# Altium project CAO_DMX.PrjPCB
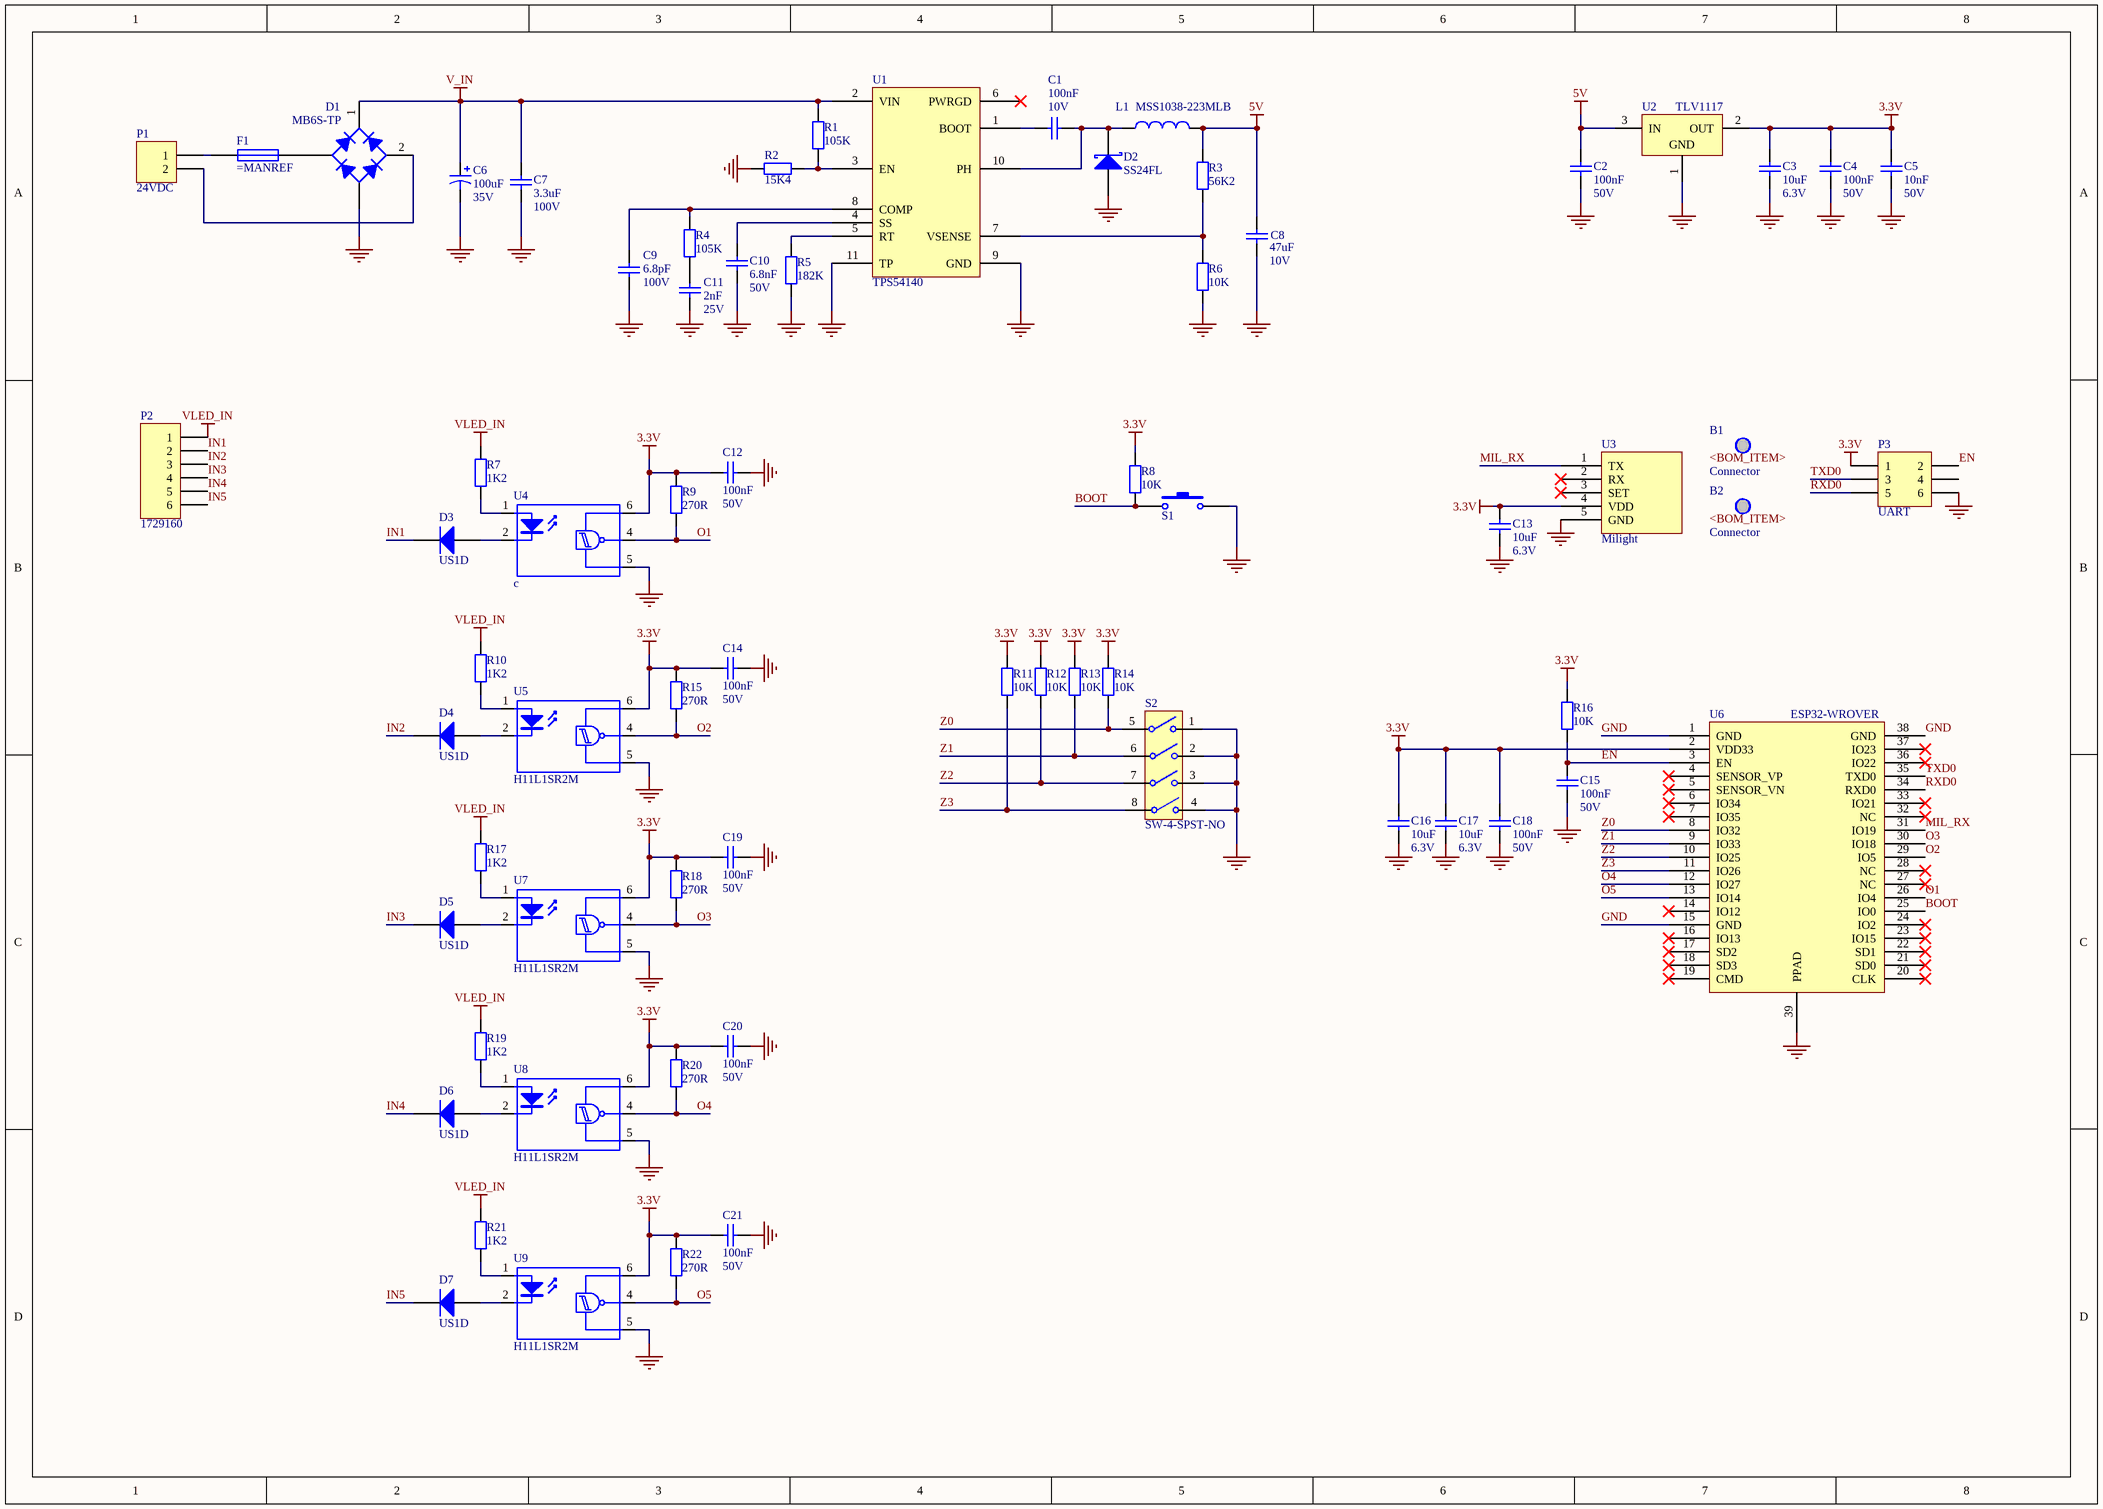
[diagram p0: CAO_DMX.SchDoc]
CompanyName: Micro-Device Tunisie; DocumentNumber: 1; DocumentScale: 1:1; DrawnBy: MG; SheetTotal: 1; Title: DMX Wifi Bridge
1 sheet, 68 parts. Net scope: global (net labels, ports and power ports of the same name join across sheets).
Board file: CAO_DMX.PcbDoc

## Sheet CAO_DMX.SchDoc: DMX Wifi Bridge
size A3; Organization: Micro Device Tunisie; Address1: Pépinière d’Entreprises Sousse-Tec; Address2: Espace Universitaire ISET SOUSSE; Address3: Cité Erriadh, 4023, Tunisia; Address4: contact@mdtunisie.com

### Parts
B1  Connector  (mechanical)
B2  Connector  (mechanical)
C1  Value 1: 100nF  Value 2: 10V  [CAPC1608N]  (hidden comment: Capacitor)
C2  Value 1: 100nF  Value 2: 50V  [CAPC1608N]  (hidden comment: Capacitor)
C3  Value 1: 10uF  Value 2: 6.3V  [CAPC2012N]  (hidden comment: Capacitor)
C4  Value 1: 100nF  Value 2: 50V  [CAPC1608N]  (hidden comment: Capacitor)
C5  Value 1: 10nF  Value 2: 50V  [CAPC1608N]  (hidden comment: Capacitor)
C6  Value 1: 100uF  Value 2: 35V  [ECAP_SMD_6.3]  (hidden comment: Polarized Capacitor)
C7  Value 1: 3.3uF  Value 2: 100V  [CAPC3216N]  (hidden comment: Capacitor)
C8  Value 1: 47uF  Value 2: 10V  [CAPC2012N]  (hidden comment: Capacitor)
C9  Value 1: 6.8pF  Value 2: 100V  [CAPC1608N]  (hidden comment: Capacitor)
C10  Value 1: 6.8nF  Value 2: 50V  [CAPC1608N]  (hidden comment: Capacitor)
C11  Value 1: 2nF  Value 2: 25V  [CAPC2012N]  (hidden comment: Capacitor)
C12  Value 1: 100nF  Value 2: 50V  [CAPC1608N]  (hidden comment: Capacitor)
C13  Value 1: 10uF  Value 2: 6.3V  [CAPC2012N]  (hidden comment: Capacitor)
C14  Value 1: 100nF  Value 2: 50V  [CAPC1608N]  (hidden comment: Capacitor)
C15  Value 1: 100nF  Value 2: 50V  [CAPC1608N]  (hidden comment: Capacitor)
C16  Value 1: 10uF  Value 2: 6.3V  [CAPC2012N]  (hidden comment: Capacitor)
C17  Value 1: 10uF  Value 2: 6.3V  [CAPC2012N]  (hidden comment: Capacitor)
C18  Value 1: 100nF  Value 2: 50V  [CAPC1608N]  (hidden comment: Capacitor)
C19  Value 1: 100nF  Value 2: 50V  [CAPC1608N]  (hidden comment: Capacitor)
C20  Value 1: 100nF  Value 2: 50V  [CAPC1608N]  (hidden comment: Capacitor)
C21  Value 1: 100nF  Value 2: 50V  [CAPC1608N]  (hidden comment: Capacitor)
D1  MB6S-TP  [MB6S]
D2  SS24FL  [SOD-123F]
D3  US1D  [DO-214AC]
D4  US1D  [DO-214AC]
D5  US1D  [DO-214AC]
D6  US1D  [DO-214AC]
D7  US1D  [DO-214AC]
F1  (no value)
L1  MSS1038-223MLB  [MSS1038]
P1  24VDC  [*TE_282843-2]
P2  1729160  [1729160]
P3  UART  [HDR2X3]
R1  Value 1: 105K  [RESC1608N]  (hidden comment: Resistor)
R2  Value 1: 15K4  [RESC1608N]  (hidden comment: Resistor)
R3  Value 1: 56K2  [RESC1608N]  (hidden comment: Resistor)
R4  Value 1: 105K  [RESC1608N]  (hidden comment: Resistor)
R5  Value 1: 182K  [RESC1608N]  (hidden comment: Resistor)
R6  Value 1: 10K  [RESC1608N]  (hidden comment: Resistor)
R7  Value 1: 1K2  [RESC6432N]  (hidden comment: Resistor)
R8  Value 1: 10K  [RESC1608N]  (hidden comment: Resistor)
R9  Value 1: 270R  [RESC1608N]  (hidden comment: Resistor)
R10  Value 1: 1K2  [RESC6432N]  (hidden comment: Resistor)
R11  Value 1: 10K  [RESC1608N]  (hidden comment: Resistor)
R12  Value 1: 10K  [RESC1608N]  (hidden comment: Resistor)
R13  Value 1: 10K  [RESC1608N]  (hidden comment: Resistor)
R14  Value 1: 10K  [RESC1608N]  (hidden comment: Resistor)
R15  Value 1: 270R  [RESC1608N]  (hidden comment: Resistor)
R16  Value 1: 10K  [RESC1608N]  (hidden comment: Resistor)
R17  Value 1: 1K2  [RESC6432N]  (hidden comment: Resistor)
R18  Value 1: 270R  [RESC1608N]  (hidden comment: Resistor)
R19  Value 1: 1K2  [RESC6432N]  (hidden comment: Resistor)
R20  Value 1: 270R  [RESC1608N]  (hidden comment: Resistor)
R21  Value 1: 1K2  [RESC6432N]  (hidden comment: Resistor)
R22  Value 1: 270R  [RESC1608N]  (hidden comment: Resistor)
S1  Switch  [FSM4]  (value not drawn)
S2  SW-4-SPST-NO  [418117270904]
U1  TPS54140  [VSON-10]
U2  TLV1117  [SOT223]
U3  Milight  [MILIGHT_RF_MODULE]
U4  c  [DIP-6]
U5  H11L1SR2M  [DIP-6]
U6  ESP32-WROVER  [ESP32-WROVER]
U7  H11L1SR2M  [DIP-6]
U8  H11L1SR2M  [DIP-6]
U9  H11L1SR2M  [DIP-6]

### Nets
3.3V: C3.2 C4.2 C5.2 C12.2 C13.2 C14.2 C16.2 C17.2 C18.2 C19.2 C20.2 C21.2 P3.1 R8.2 R9.2 R11.2 R12.2 R13.2 R14.2 R15.2 R16.2 R18.2 R20.2 R22.2 U2.2(OUT) U3.4(VDD) U4.6(VCC) U5.6(VCC) U6.2(VDD33) U7.6(VCC) U8.6(VCC) U9.6(VCC)
5V: C2.2 C8.2 L1.2 R3.2 U2.3(IN)
GND: C2.1 C3.1 C4.1 C5.1 C6.2 C7.1 C8.1 C9.1 C10.1 C11.1 C12.1 C13.1 C14.1 C15.1 C16.1 C17.1 C18.1 C19.1 C20.1 C21.1 D1.3(A) D2.1(A) P3.6 R2.1 R5.1 R6.1 S1.2 S2.1 S2.2 S2.3 S2.4 U1.9(GND) U1.11(TP) U2.1(GND) U3.5(GND) U4.5(GND) U5.5(GND) U6.1(GND) U6.15(GND) U6.38(GND) U6.39(PPAD) U7.5(GND) U8.5(GND) U9.5(GND)
V_IN: C6.1 C7.2 D1.1(K) R1.2 U1.2(VIN)
VLED_IN: P2.1 R7.2 R10.2 R17.2 R19.2 R21.2
BOOT: R8.1 S1.1 U6.25(IO0)
EN: C15.2 P3.2 R16.1 U6.3(EN)
IN1: D3.2(K) P2.2
IN2: D4.2(K) P2.3
IN3: D5.2(K) P2.4
IN4: D6.2(K) P2.5
IN5: D7.2(K) P2.6
MIL_RX: U3.1(TX) U6.31(IO19)
O1: R9.1 U4.4(VO) U6.26(IO4)
O2: R15.1 U5.4(VO) U6.29(IO5)
O3: R18.1 U6.30(IO18) U7.4(VO)
O4: R20.1 U6.12(IO27) U8.4(VO)
O5: R22.1 U6.13(IO14) U9.4(VO)
RXD0: P3.5 U6.34(RXD0)
TXD0: P3.3 U6.35(TXD0)
Z0: R14.1 S2.5 U6.8(IO32)
Z1: R13.1 S2.6 U6.9(IO33)
Z2: R12.1 S2.7 U6.10(IO25)
Z3: R11.1 S2.8 U6.11(IO26)
NetC1_1: C1.1 U1.1(BOOT)
NetC1_2: C1.2 D2.2(K) L1.1 U1.10(PH)
NetC9_2: C9.2 R4.2 U1.8(COMP)
NetC10_2: C10.2 U1.4(SS)
NetC11_2: C11.2 R4.1
NetD1_2: D1.2(C) P1.2
NetD1_4: D1.4(C) F1.2
NetD3_1: D3.1(A) U4.2(K)
NetD4_1: D4.1(A) U5.2(K)
NetD5_1: D5.1(A) U7.2(K)
NetD6_1: D6.1(A) U8.2(K)
NetD7_1: D7.1(A) U9.2(K)
NetF1_1: F1.1 P1.1
NetR1_1: R1.1 R2.2 U1.3(EN)
NetR3_1: R3.1 R6.2 U1.7(VSENSE)
NetR5_2: R5.2 U1.5(RT)
NetR7_1: R7.1 U4.1(A)
NetR10_1: R10.1 U5.1(A)
NetR17_1: R17.1 U7.1(A)
NetR19_1: R19.1 U8.1(A)
NetR21_1: R21.1 U9.1(A)

Not connected (* = marked no-connect by the designer): P3 4; U1 6(PWRGD)*; U3 2(RX)* 3(SET)*; U6 4(SENSOR_VP)* 5(SENSOR_VN)* 6(IO34)* 7(IO35)* 14(IO12)* 16(IO13)* 17(SD2)* 18(SD3)* 19(CMD)* 20(CLK)* 21(SD0)* 22(SD1)* 23(IO15)* 24(IO2)* 27(NC)* 28(NC)* 32(NC)* 33(IO21)* 36(IO22)* 37(IO23)*

### Notes on the sheet
- (in symbol MIS-000000019) <BOM_ITEM>

### Library data of the parts
B1 = MIS-000000019: BOM item; MAN: MULTICOMP; MANREF: 2212S-05SG-85; DES: 2212S-05SG-85 -  Connecteur carte-à-carte, 2.54 mm, 5 Contact(s), Embase, Série 2212S, Traversant, 1 Rangée(s); Value 1: 2.54mm; Value 2: 5 pins; TOL: _; SUP: Farnell; SUPREF: 1593461; Part Number: MIS-000000019; FTP: _; NOTE: _
B2 = MIS-000000019: BOM item; MAN: MULTICOMP; MANREF: 2211S-05G; DES: 2211S-05G -  Connecteur carte-à-carte, Vertical, 2.54 mm, 5 Contact(s), Embase, Série 2211S, Traversant; Value 1: 2.54mm; Value 2: 5 pins; TOL: _; SUP: Farnell; SUPREF: 1593414; Part Number: MIS-000000019; FTP: _; NOTE: _
C1 = CAP-000000040: MAN: KEMET; MANREF: C0603X104K8RACTU; DES: C0603X104K8RACTU -  Condensateur céramique multicouche CMS, 0.1 µF, 10 V, 0603 [1608 Metric], ± 10%, X7R; TOL: 10%; FTP: 0603; SUP: Farnell; SUPREF: 2904937; NOTE: _; Part Number: CAP-000000040
C2 C4 = CAP-000000003: DES: MULTICOMP  MC0603F104Z500CT  CONDENSATEUR MLCC Y5V 100NF 0603; TOL: +80% -20%; MAN: MULTICOMP; MANREF: MC0603F104Z500CT; FTP: 0603; SUP: Farnell; SUPREF: 1759123; NOTE: _; Part Number: CAP-000000003
C3 C13 C16 C17 = CAP-000000042: MAN: MULTICOMP; MANREF: MCTT21X106M6R3CT; DES: MCTT21X106M6R3CT -  Condensateur céramique multicouche CMS, 10 µF, 6.3 V, 0805 [2012 Metric], ± 20%, X5R, Série MCTT; TOL: 20%; FTP: 0805; SUP: Farnell; SUPREF: 1759476; NOTE: _; Part Number: CAP-000000042
C5 = CAP-000000002: DES: MULTICOMP  MC0603B103K500CT  CONDENSATEUR MLCC X7R 10NF 50V 0603; TOL: 10%; MAN: MULTICOMP; MANREF: MC0603B103K500CT; FTP: 0603; SUP: Farnell; SUPREF: 1759102; NOTE: _; Part Number: CAP-000000002
C6 = CAP-000000008: MAN: PANASONIC; MANREF: EEEFK1V101XP; DES: PANASONIC ELECTRONIC COMPONENTS  EEEFK1V101XP  CONDENSATEUR ELEC ALU 100UF 35V CMS; TOL: 20%; FTP: SMD Size D8; SUP: Farnell; SUPREF: 1850114; NOTE: _; Part Number: CAP-000000008
C7 = CAP-000000036: MAN: TDK; MANREF: CGA5L3X7S2A335M160AB; DES: Multilayer Ceramic Capacitors MLCC - SMD/SMT CGA 1206 100V 3.3uF X7S 20% AEC-Q200; TOL: 20%; FTP: 1206; SUP: Mouser; SUPREF: 810-CGA5L3X7S2A335MB; NOTE: _; Part Number: CAP-000000036
C8 = CAP-000000041: MAN: MURATA; MANREF: GRM21BR61A476ME15L; DES: GRM21BR61A476ME15L -  Condensateur céramique multicouche CMS, 47 µF, 10 V, 0805 [2012 Metric], ± 20%, X5R, GRM Series; TOL: 20%; FTP: 0805; SUP: Farnell; SUPREF: 2611939; NOTE: _; Part Number: CAP-000000041
C9 = CAP-000000037: MAN: AVX; MANREF: 06031U6R8BAT2A; DES: Multilayer Ceramic Capacitors MLCC - SMD/SMT 100V 6.8pF C0G 0603 .1pF Tol; TOL: _; FTP: 0603; SUP: Mouser; SUPREF: 581-06031U6R8BAT2A; Part Number: CAP-000000037; NOTE: _
C10 = CAP-000000039: MAN: KEMET; MANREF: C0603X682K5GECAUTO; DES: C0603X682K5GECAUTO -  Condensateur céramique multicouche CMS, ESD, AEC-Q200, 6800 pF, 50 V, 0603 [1608 Metric], ± 10%; TOL: 10%; FTP: 0603; SUP: Farnell; SUPREF: 2760504; NOTE: _; Part Number: CAP-000000039
C11 = CAP-000000038: MAN: KEMET; MANREF: C0805C202J3GACTU; DES: C0805C202J3GACTU -  Condensateur céramique multicouche CMS, 2000 pF, 25 V, 0805 [2012 Metric], ± 5%, C0G / NP0; TOL: 5%; FTP: 0805; SUP: Farnell; SUPREF: 2905236; NOTE: _; Part Number: CAP-000000038
C12 C14 C15 C18-C21 = CAP-000000003: MAN: MULTICOMP; MANREF: MC0603F104Z500CT; DES: MULTICOMP  MC0603F104Z500CT  CONDENSATEUR MLCC Y5V 100NF 0603; TOL: +80% -20%; FTP: 0603; SUP: Farnell; SUPREF: 1759123; NOTE: _; Part Number: CAP-000000003
D1 = DIB-000000002: Full Wave Diode Bridge; MAN: Micro Commercial Components (MCC); DES: Redresseurs en pont .5A 600V; Value 1: 0.5A; Value 2: 600V; TOL: _; FTP: MBS-1; SUP: Mouser; SUPREF: 833-MB6S-TP; Part Number: DIB-000000002; MANREF: MB6S-TP; NOTE: _
D2 = DIS-000000016: Schottky Diode; MAN: ON Semiconductor / Fairchild; DES: Schottky Diodes & Rectifiers 40V, 2A SCHOTTKY; Value 1: 2A; Value 2: 40V; TOL: _; FTP: SOD-123-2; SUP: Mouser; SUPREF: 512-SS24FL; Part Number: DIS-000000016; MANREF: SS24FL; NOTE: _
D3-D7 = DIR-000000002: Diode; MAN: MULTICOMP; DES: Diode Fast / U, 200 V, 1 A, Une, 1 V, 50 ns, 30 A; Value 1: 1A; Value 2: 200V; TOL: _; SUP: Farnell; SUPREF: 1625280; Part Number: DIR-000000002; MANREF: US1D; FTP: DO-214AC; NOTE: _
F1 = Fuse
L1 = IND-000000012: Inductor; MAN: Coilcraft; DES: Fixed Inductors MSS1038 SMT Shielded 22 uH 20 % 2.85 A; Value 1: 22uH; Value 2: 2.85A; TOL: 20%; FTP: _; SUP: Mouser; SUPREF: 994-MSS1038-223MLB; Part Number: IND-000000012; MANREF: MSS1038-223MLB; NOTE: _
P1 = CON-000000036: Header, 2-Pin; MAN: Wurth Elektronik; MANREF: 691213610002 / 39910-0102; DES: Fixed Terminal Blocks WR-TBL Terminal Block - Rising Cage - THT 2 Positions 10.16 mm Pitch 14A; Value 1: 2pts; Value 2: 10.16 mm; TOL: _; FTP: THT; SUP: Mouser; SUPREF: 710-691213610002; Part Number: CON-000000036; NOTE: _
P2 = CON-000000035: Header, 6-Pin; MAN: Phoenix Contact; DES: Fixed Terminal Blocks 6P 5.08mm 90DEG; Value 1: 6pts; Value 2: 5.08 mm; TOL: _; FTP: THT; SUP: Mouser; SUPREF: 651-1729160; Part Number: CON-000000035; MANREF: 1729160; NOTE: _
P3 = CON-000000012: Header, 3-Pin, Dual row; MAN: Wurth Electronics; MANREF: 61300621121; DES: Embases et logements de câbles WR-PHD 2.54mm Hdr 6P Dual Str Gold; Value 1: 6pts; Value 2: _; FTP: THT; SUP: Mouser; SUPREF: 710-61300621121; Part Number: CON-000000012; TOL: _; NOTE: _
R1 R4 = RES-000000070: MAN: PANASONIC ELECTRONIC COMPONENT; MANREF: ERJ3EKF1053V; DES: ERJ3EKF1053V -  Résistance à puce CMS, Couche épaisse, 105 kohm, Série ERJ3E, 75 V, Couche épaisse; Value 2: 0.1W; TOL: 1%; FTP: 0603; SUP: Farnell; SUPREF: 2059494; NOTE: _; Part Number: RES-000000070
R2 = RES-000000085: MAN: VISHAY; MANREF: CRCW060315K4FKEA; DES: CRCW060315K4FKEA. -  Résistance à puce CMS, Couche épaisse, 0603 [1608 Metric], 15.4 kohm, Série CRCW, 75 V; Value 2: 0.1W; TOL: 1%; FTP: 0603; SUP: Farnell; SUPREF: 2138431; NOTE: _; Part Number: RES-000000085
R3 = RES-000000086: MAN: MCWR06X5622FTL -  Résistance à puce CMS, 56.2 kohm, MCWR06 Series, 75 V, Couche épaisse, 0603 [1608 Metric], 100 mW; MANREF: MCWR06X5622FTL; Value 2: 0.1W; TOL: 1%; FTP: 0603; SUP: Farnell; SUPREF: 2694903; NOTE: _; Part Number: RES-000000086; DES: MCWR06X5622FTL -  Résistance à puce CMS, 56.2 kohm, MCWR06 Series, 75 V, Couche épaisse, 0603 [1608 Metric], 100 mW
R5 = RES-000000084: MAN: PANASONIC ELECTRONIC COMPONENTS; MANREF: ERJ3EKF1823V; DES: ERJ3EKF1823V -  Résistance à puce CMS, Couche épaisse, 182 kohm, Série ERJ3E, 75 V, Couche épaisse; Value 2: 0.1W; TOL: 1%; FTP: 0603; SUP: Farnell; SUPREF: 2059508; NOTE: _; Part Number: RES-000000084
R6 R8 R11-R14 R16 = RES-000000003: MAN: YAGEO; MANREF: RC0603FR-0710KL; DES: YAGEO (PHYCOMP)  RC0603FR-0710KL  RESISTANCE COUCHE EPAISSE 10K 0.1W 1%; Value 2: 0.1W; TOL: 1%; FTP: 0603; SUP: Farnell; SUPREF: 9238603; NOTE: _; Part Number: RES-000000003
R7 R10 R17 R19 R21 = RES-000000095: MAN: PANASONIC; MANREF: ERJ1TYJ122U; DES: ERJ1TYJ122U -  Résistance à puce CMS, Couche épaisse, 2512 [6432 Metric], 1.2 kohm, Série ERJ1T, 200 V; Value 2: 1W; TOL: 5%; FTP: 2512; SUP: Farnell; SUPREF: 2324174; NOTE: _; Part Number: RES-000000095
R9 R15 R18 R20 R22 = RES-000000094: MAN: VISHAY; MANREF: CRCW0603270RFKEA; DES: CRCW0603270RFKEA. -  Résistance à puce CMS, Couche épaisse, 0603 [1608 Metric], 270 ohm, Série CRCW, 75 V; Value 2: 0.1W; TOL: 1%; FTP: 0603; SUP: Farnell; SUPREF: 2141320; NOTE: _; Part Number: RES-000000094
S1 = MIS-000000020: MAN: ALCOSWITCH - TE CONNECTIVITY; MANREF: FSM4JSMA; DES: FSM4JSMA -  Commutateur tactile, Série FSMJSMA, A déclencheur supérieur, Montage en surface, Bouton rond; Value 1: _; SUP: Farnell; SUPREF: 3801305; Part Number: MIS-000000020; Value 2: _; TOL: _; FTP: _; NOTE: _
S2 = SWC-000000004: MAN: Wurth Elektronik; DES: Commutateurs DIL/Commutateurs SIL WS-DITV DIP 4p THT 2.54mm Hrztl Box; Value 1: _; SUP: Mouser; SUPREF: 710-418117270904; Part Number: SWC-000000004; MANREF: 418117270904; Value 2: _; TOL: _; FTP: _; NOTE: _
U1 = ICP-000000006: 4-V to 40-V, 1-A Step-Down Converter With High Efficiency Eco-Mode; MAN: Texas Instruments; MANREF: TPS54140ADRCT; DES: Switching Voltage Regulators 3.5-42Vin,1.5A SD Converter; Value 1: _; SUP: Mouser; SUPREF: 595-TPS54140ADRCT; Part Number: ICP-000000006; Value 2: _; TOL: _; FTP: VSON-10; NOTE: _
U2 = VRG-000000001: Voltage Regulator; MAN: Texas Instrument; MANREF: TLV1117LV33DCYR; DES: TEXAS INSTRUMENTS  TLV1117LV33DCYR  LDO FIXE 3.3V 1A SOT-223-4; Value 1: 3.3V; Value 2: 1A; TOL: _; FTP: SOT-223; SUP: Farnell; SUPREF: 3122356; Part Number: VRG-000000001; NOTE: _
U3 = RFC-000000003: MANREF: PCB-KH01; DES: RF Module; Value 1: _; SUP: Deliled; Part Number: RFC-000000003; MAN: Milight; Value 2: _; TOL: _; FTP: _; SUPREF: PCB-KH01; NOTE: _
U4 U5 U7-U9 = OPT-000000005: Schmitt Trigger Output Optocoupler; MAN: ON SEMICONDUCTOR; DES: H11L1SR2M -  Optocoupleur, 1 voie, 7.5 kV, Montage en surface DIP, 6 Broche(s); Value 1: _; SUP: Farnell; SUPREF: 1086683; Part Number: OPT-000000005; Value 2: _; TOL: _; FTP: DIP-6; NOTE: _
  U4: MANREF: c
  U5 U7-U9: MANREF: H11L1SR2M
U6 = RFC-000000002: Modules WiFi / 802.11 SMD Module, ESP32-D0WDQ6, 32Mbits PSRAM, 32Mbits SPI flash, PCB Antenna; MAN: Espressif Systems; Value 1: _; SUP: ASTONE TECHNOLOGY; Part Number: RFC-000000002; MANREF: ESP32-WROVER; DES: Modules WiFi / 802.11 SMD Module, ESP32-D0WDQ6, 32Mbits PSRAM, 32Mbits SPI flash, PCB Antenna; Value 2: _; TOL: _; FTP: _; SUPREF: ESP32-WROVER; NOTE: _